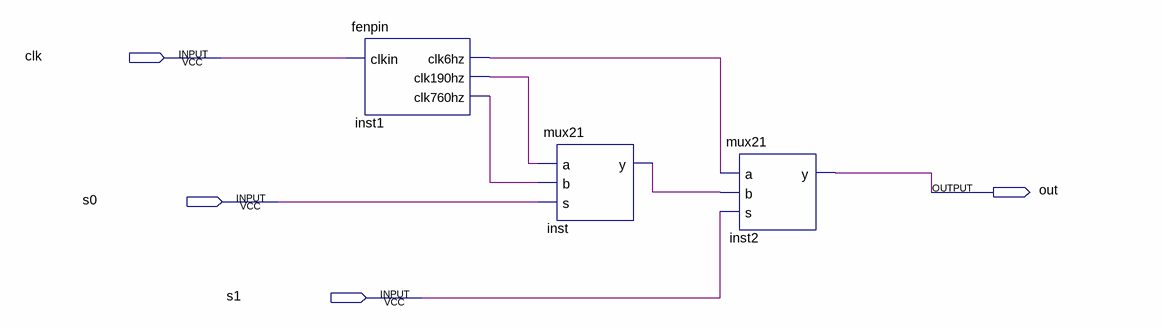
[diagram p0: schematic sheet]
// Quartus schematic muxk.bdf as structural Verilog: 3 symbols, 4 pins
module muxk (
  input  clk,
  input  s0,
  input  s1,
  output out
);

  wire inst1_clk6hz, inst1_clk190hz, inst1_clk760hz, inst_y;

  fenpin inst1 (.clkin(clk), .clk6hz(inst1_clk6hz), .clk190hz(inst1_clk190hz), .clk760hz(inst1_clk760hz));
  mux21 inst (.a(inst1_clk190hz), .b(inst1_clk760hz), .s(s0), .y(inst_y));
  mux21 inst2 (.a(inst1_clk6hz), .b(inst_y), .s(s1), .y(out));
endmodule
